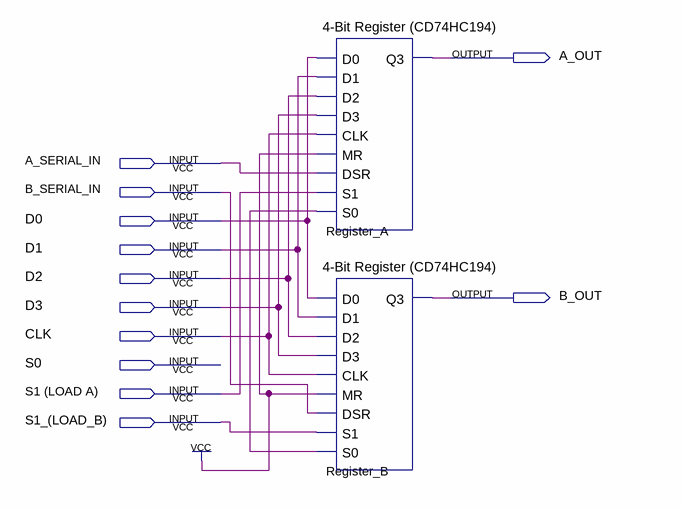
[diagram p0: schematic sheet]
// Quartus schematic Storage.bdf as structural Verilog: 2 symbols, 12 pins
module Storage (
  input  A_SERIAL_IN,
  input  B_SERIAL_IN,
  input  D0,
  input  D1,
  input  D2,
  input  D3,
  input  CLK,
  input  S0,
  input  \S1_(LOAD_A) ,
  input  \S1_(LOAD_B) ,
  output A_OUT,
  output B_OUT
);

  wire undriven;

  \4-Bit_Register_(CD74HC194)  Register_A (
    .D0(D0), .D1(D1), .D2(D2), .D3(D3), .CLK(CLK), .MR(1'b1), .DSR(A_SERIAL_IN), .S1(\S1_(LOAD_A) ),
    .S0(undriven), .Q3(A_OUT));
  \4-Bit_Register_(CD74HC194)  Register_B (
    .D0(D0), .D1(D1), .D2(D2), .D3(D3), .CLK(CLK), .MR(1'b1), .DSR(B_SERIAL_IN), .S1(\S1_(LOAD_B) ),
    .S0(undriven), .Q3(B_OUT));
endmodule
